# EAGLE design Placa (EAGLE 8.3.1)
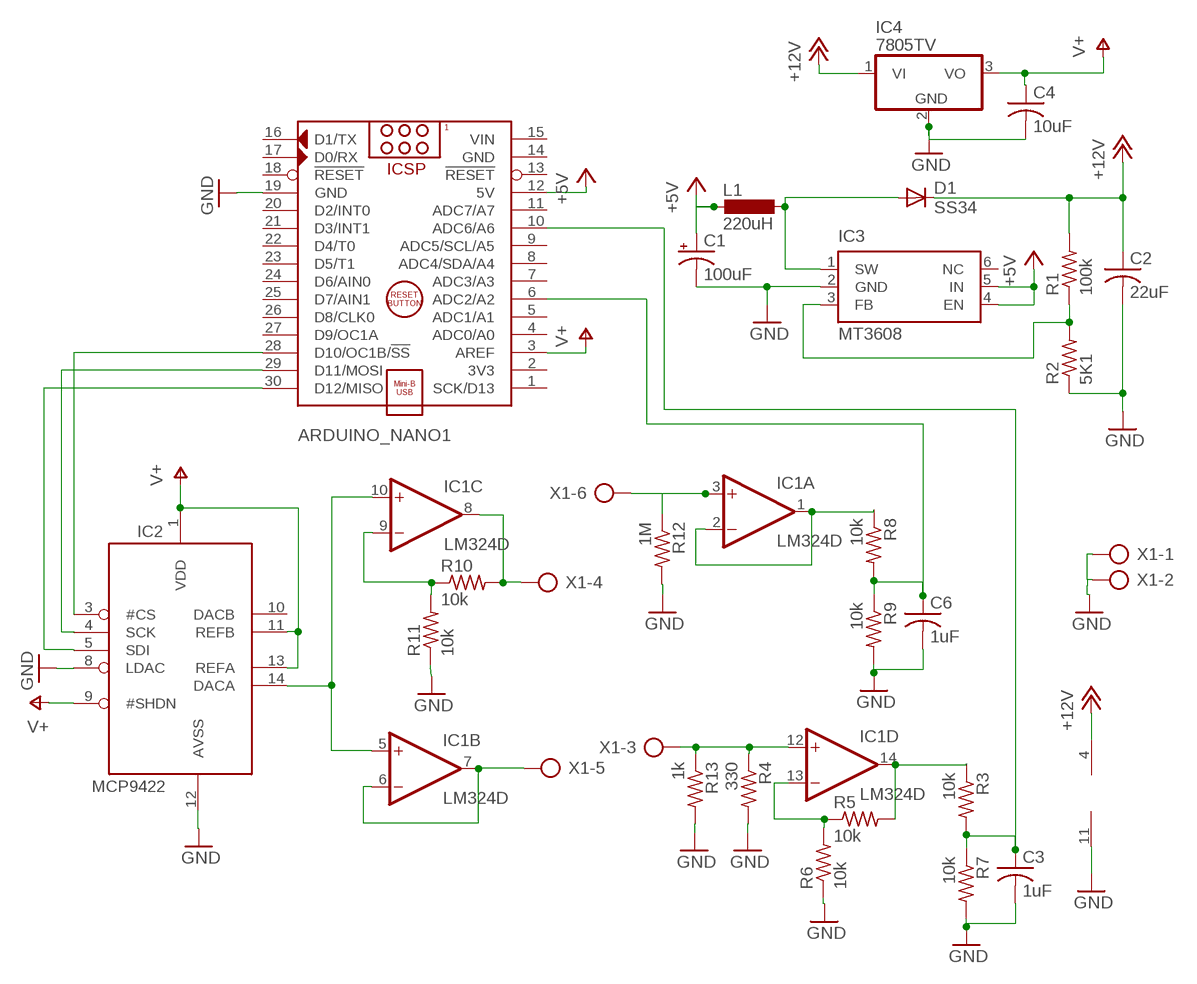
[diagram p0: schematic, sheet 1]

## Parts
ARDUINO_NANO1  ARDUINO_NANO  [ARDUINO_NANO]
C1  100uF  CPOL-USE2.5-6  [E2,5-6]
C2  22uF  C-USC1206  [C1206]
C3  1uF  C-USC0805  [C0805]
C4  10uF  C-USC0805  [C0805]
C6  1uF  C-USC0805  [C0805]
D1  SS34  DIODE-DO-214AC  [DO-214AC]
IC1  LM324D  [SO14]
IC2  MCP4922  MCP4922MCP4922-SO14  [SO14]
IC3  MT3608  STF202-22T1G  [SOT23-6]
IC4  7805TV  [TO220V]
L1  220uH  DO3316P  [DO3316P]
R1  100k  R-US_R0805  [R0805]
R2  5K1  R-US_R0805  [R0805]
R3  10k  R-US_R0805  [R0805]
R4  330  R-US_R0805  [R0805]
R5  10k  R-US_R0805  [R0805]
R6  10k  R-US_R0805  [R0805]
R7  10k  R-US_R0805  [R0805]
R8  10k  R-US_R0805  [R0805]
R9  10k  R-US_R0805  [R0805]
R10  10k  R-US_R0805  [R0805]
R11  10k  R-US_R0805  [R0805]
R12  1M  R-US_R0805  [R0805]
R13  1k  R-US_R0805  [R0805]
X1  AK500/6  [AK500/6]

## Nets
+5V: ARDUINO_NANO1.12(5V) C1.+ IC3.4(EN) IC3.5(IN) L1.1
+12V: C2.1 D1.C IC1.4(P:V+) IC4.1(VI) R1.2
GND: ARDUINO_NANO1.19(GND) C1.- C2.2 C3.2 C4.2 C6.2 IC1.11(P:V-) IC2.8(LDAC) IC2.12(AVSS) IC3.2(GND) IC4.2(GND) R2.1 R4.2 R6.1 R7.2 R9.2 R11.1 R12.2 R13.2 X1.1 X1.2
N$1: D1.A IC3.1(SW) L1.2
N$2: ARDUINO_NANO1.28(D10/OC1B/!SS) IC2.3(#CS)
N$3: ARDUINO_NANO1.29(D11/MOSI) IC2.4(SCK)
N$4: ARDUINO_NANO1.30(D12/MISO) IC2.5(SDI)
N$5: IC3.3(FB) R1.1 R2.2
N$6: IC1.14(D:OUT) R3.1 R5.2
N$7: IC1.9(C:-IN) R10.1 R11.2
N$8: IC1.12(D:+IN) R4.1 R13.1 X1.3
N$9: IC1.13(D:-IN) R5.1 R6.2
N$10: ARDUINO_NANO1.6(ADC2/A2) C6.1 R8.2 R9.1
N$11: IC1.3(A:+IN) R12.1 X1.6
N$12: IC1.1(A:OUT) IC1.2(A:-IN) R8.1
N$14: IC1.6(B:-IN) IC1.7(B:OUT) X1.5
N$16: IC1.8(C:OUT) R10.2 X1.4
N$17: IC1.5(B:+IN) IC1.10(C:+IN) IC2.14(DACA)
N$18: ARDUINO_NANO1.10(ADC6/A6) C3.1 R3.2 R7.1
V+: ARDUINO_NANO1.3(AREF) C4.1 IC2.1(VDD) IC2.9(#SHDN) IC2.11(REFB) IC2.13(REFA) IC4.3(VO)
Unconnected: ARDUINO_NANO1.1(SCK/D13) ARDUINO_NANO1.2(3V3) ARDUINO_NANO1.4(ADC0/A0) ARDUINO_NANO1.5(ADC1/A1) ARDUINO_NANO1.7(ADC3/A3) ARDUINO_NANO1.8(ADC4/SDA/A4) ARDUINO_NANO1.9(ADC5/SCL/A5) ARDUINO_NANO1.11(ADC7/A7) ARDUINO_NANO1.13(!RESET) ARDUINO_NANO1.16(D1/TX) ARDUINO_NANO1.17(D0/RX) ARDUINO_NANO1.18(!RESET) ARDUINO_NANO1.20(D2/INT0) ARDUINO_NANO1.21(D3/INT1) ARDUINO_NANO1.22(D4/T0) ARDUINO_NANO1.23(D5/T1) ARDUINO_NANO1.24(D6/AIN0) ARDUINO_NANO1.25(D7/AIN1) ARDUINO_NANO1.26(D8/CLK0) ARDUINO_NANO1.27(D9/OC1A) IC2.10(DACB) IC3.6(NC)

## Power pins joined to a net without a drawn wire
GND: ARDUINO_NANO1.14(GND)
VIN: ARDUINO_NANO1.15(VIN)

## Library data of the parts
ARDUINO_NANO1 = ArduinoNanoV30:ARDUINO_NANO: Arduino Nano V3.0 Module Overview: The Arduino Nano is a small, complete, and breadboard-friendly board based on the ATmega328 (Arduino Nano 3.x) or ATmega168 (Arduino Nano 2.x). It has more or less the same functionality of the Arduino Duemilanove, but in a different package. It lacks only a DC power jack, and works with a Mini-B USB cable instead of a standard one. The Nano was designed and is being produced by Gravitech <http://www.gravitech.us/arna30wiatp.html>. General specifications: Item Value Microcontroller Atmel ATmega168 or ATmega328 Operating Voltage (logic level) 5 V Input Voltage (recommended) 7-12 V Input Voltage (limits) 6-20 V Digital I/O Pins 14 (of which 6 provide PWM output) Analog Input Pins 8 DC Current per I/O Pin 40 mA Flash Memory 16 KB (ATmega168) or 32 KB (ATmega328) of which 2 KB used by bootloader SRAM 1 KB (ATmega168) or 2 KB (ATmega328) EEPROM 512 bytes (ATmega168) or 1 KB (ATmega328) Clock Speed 16 MHz Dimensions (Inches) 0.73" x 1.70" Dimensions (mm) 18mm x 45mm Overall height About 9 mm (not including pins) Weigth 5 g Power: The Arduino Nano can be powered via the Mini-B USB connection, 6-20V unregulated external power supply (pin 30), or 5V regulated external power supply (pin 27). The power source is automatically selected to the highest voltage source. Memory: The ATmega168 has 16 KB of flash memory for storing code (of which 2 KB is used for the bootloader); the ATmega328 has 32 KB, (also with 2 KB used for the bootloader). The ATmega168 has 1 KB of SRAM and 512 bytes of EEPROM (which can be read and written with the EEPROM library); the ATmega328 has 2 KB of SRAM and 1 KB of EEPROM. Input and Output: Each of the 14 digital pins on the Nano can be used as an input or output, using pinMode(), digitalWrite(), and digitalRead() functions. They operate at 5 volts. Each pin can provide or receive a maximum of 40 mA and has an internal pull-up resistor (disconnected by default) of 20-50 kOhms. In addition, some pins have specialized functions. Visit Arduino - ArduinoBoardNano <https://www.arduino.cc/en/Main/ArduinoBoardNano>
C1 = rcl:CPOL-US: POLARIZED CAPACITOR, American symbol
C2-C4 C6 = rcl:C-US: CAPACITOR, American symbol
D1 = diode:DIODE-: DIODE
IC1 = linear:LM324: OP AMP
IC2 = adafruit2:MCP4922
IC3 = MT3608:STF202-22T1G: USB Filter with ESD Protection Source: http://www.onsemi.com/pub_link/Collateral/STF202-22T1-D.PDF; MF: ON Semiconductor; MPN: STF202-22T1G; OC_FARNELL: 1651958; OC_NEWARK: 45J2271
IC4 = linear:78*: Positive VOLTAGE REGULATOR Source: http://cache.national.com/ds/LM/LM78L05.pdf http://www.fairchildsemi.com/ds/LM/LM7805.pdf
L1 = inductor-coilcraft:DO3316P: COILCRAFT; OC_FARNELL: unknown; OC_NEWARK: unknown
R1-R13 = resistor:R-US_: RESISTOR, American symbol
X1 = con-ptr500:AK500/6: CONNECTOR; OC_FARNELL: unknown; OC_NEWARK: unknown

## Net classes
0 default: width 0.381 mm, clearance 0.102 mm

## Board
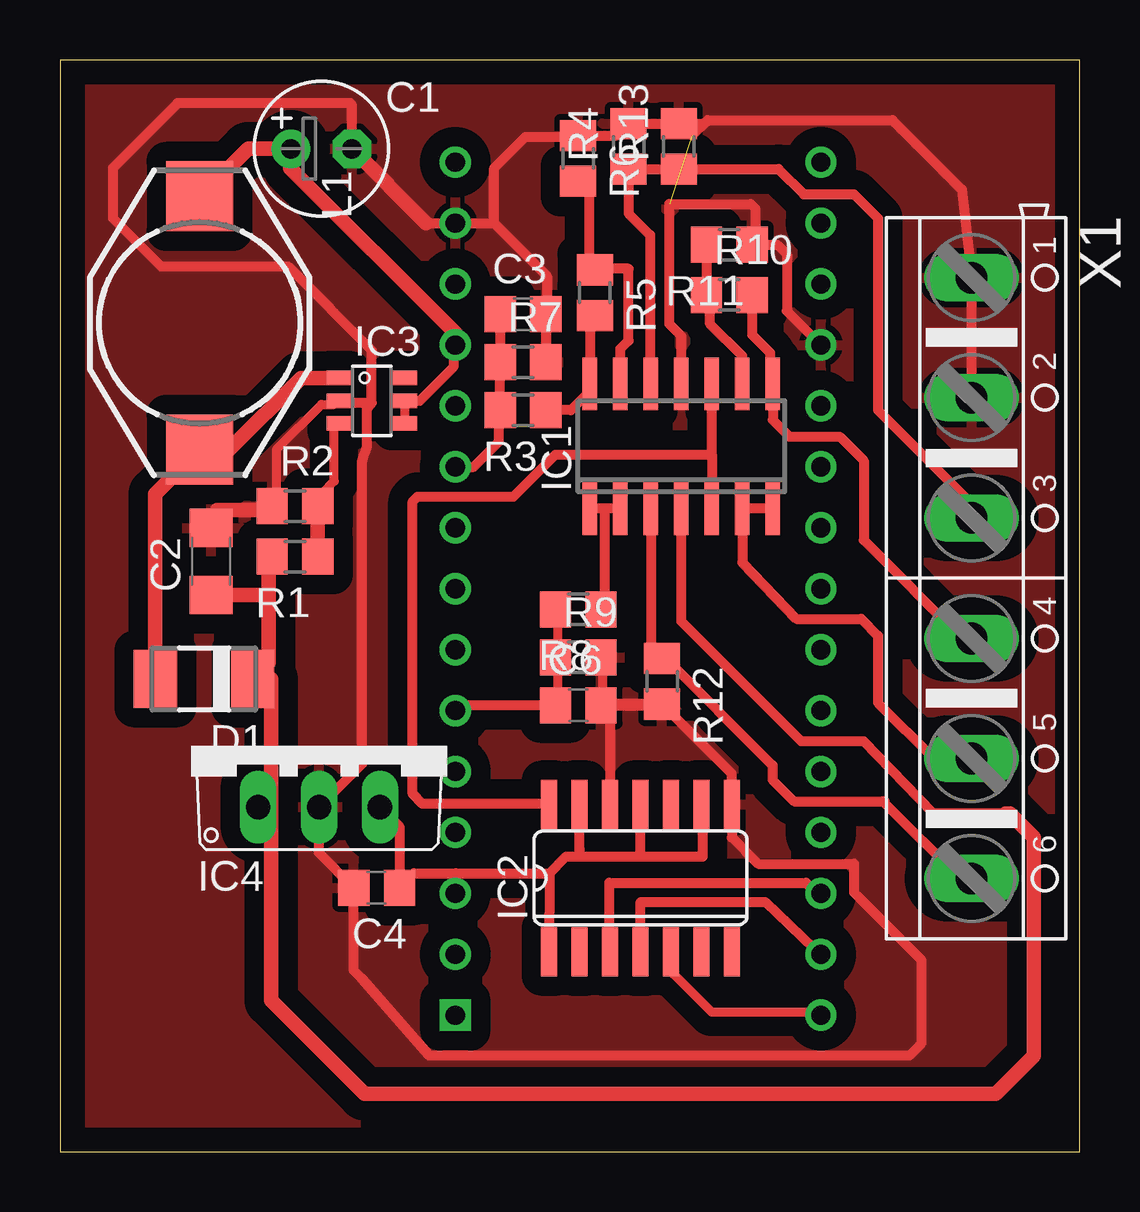
[diagram p1: board, top side]
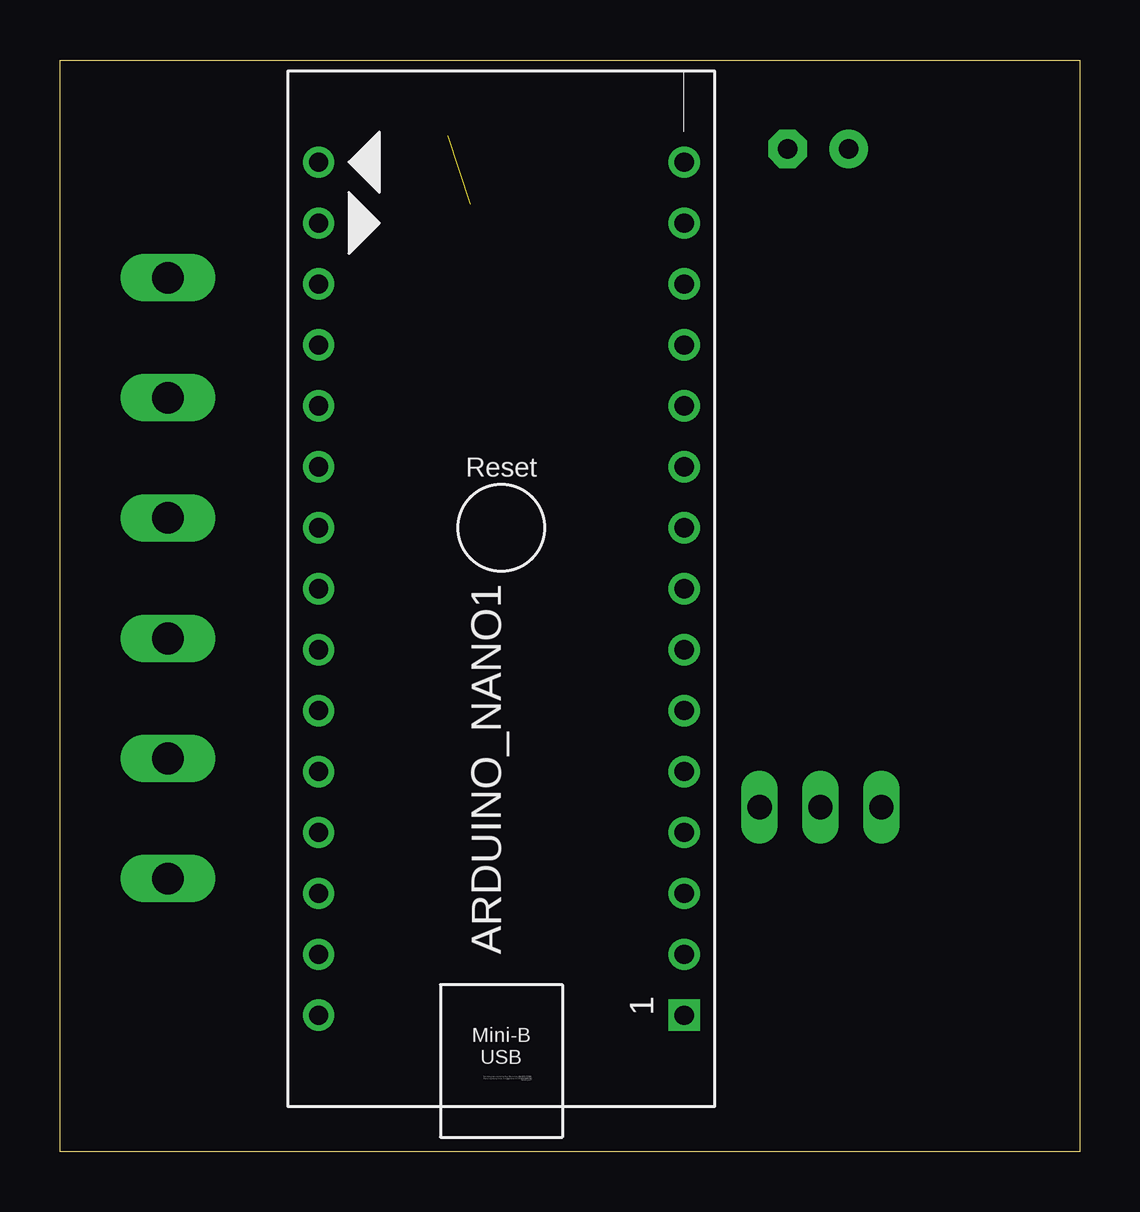
[diagram p2: board, bottom side, seen from below]

Size 42.5 x 45.5 mm. Coordinates in mm from the lower left corner, seen from the top.
Outline: 0,0 42.5,0 42.5,45.5 0,45.5 0,0
Copper layers (1*16): Top 0.035mm / dielectric 1.5mm / Bottom 0.035mm
Design rules "default": minimum track width 6mil, minimum drill 0.35mm, track to track 6mil, track to pad 6mil, pad to pad 6mil, via to via 6mil, smd to smd 6mil, copper to edge 40mil, drill to drill 6mil, minimum pad ring 10mil, minimum via ring 8mil, stop-mask expansion 4mil, vias tented up to drill 0mil, thermal gap 10mil

### Footprints (pad centres in the part's own frame; a part is rotated, then mirrored left to right if it is on the bottom)
ARDUINO_NANO = drill 0.8 square: 1 -20.32,-7.62 | drill 0.8: 2 -17.78,-7.62; 3 -15.24,-7.62; 4 -12.7,-7.62; 5 -10.16,-7.62; 6 -7.62,-7.62; 7 -5.08,-7.62; 8 -2.54,-7.62; 9 0,-7.62; 10 2.54,-7.62; 11 5.08,-7.62; 12 7.62,-7.62; 13 10.16,-7.62; 14 12.7,-7.62; 15 15.24,-7.62; 16 15.24,7.62; 17 12.7,7.62; 18 10.16,7.62; 19 7.62,7.62; 20 5.08,7.62; 21 2.54,7.62; 22 0,7.62; 23 -2.54,7.62; 24 -5.08,7.62; 25 -7.62,7.62; 26 -10.16,7.62; 27 -12.7,7.62; 28 -15.24,7.62; 29 -17.78,7.62; 30 -20.32,7.62
E2,5-6 = drill 0.813 pad 1.6: + -1.27,0 | drill 0.813 pad 1.6 octagon: - 1.27,0
C1206 = smd 1.6 x 1.8: 1 -1.4,0; 2 1.4,0
C0805 = smd 1.3 x 1.5: 1 -0.95,0; 2 0.95,0
DO-214AC = smd 1.8 x 2.4: A 2.025,0; C -2.025,0
SO14 = smd 0.6 x 2.2: 1 -3.81,-2.6; 2 -2.54,-2.6; 3 -1.27,-2.6; 4 0,-2.6; 5 1.27,-2.6; 6 2.54,-2.6; 7 3.81,-2.6; 8 3.81,2.6; 9 2.54,2.6; 10 1.27,2.6; 11 0,2.6; 12 -1.27,2.6; 13 -2.54,2.6; 14 -3.81,2.6
SO14' = smd 0.66 x 2.032: 1 -3.81,-3.073; 2 -2.54,-3.073; 3 -1.27,-3.073; 4 0,-3.073; 5 1.27,-3.073; 6 2.54,-3.073; 7 3.81,-3.073; 8 3.81,3.073; 9 2.54,3.073; 10 1.27,3.073; 11 0,3.073; 12 -1.27,3.073; 13 -2.54,3.073; 14 -3.81,3.073
SOT23-6 = smd 0.6 x 1.05: 1 -0.95,-1.35; 2 0,-1.35; 3 0.95,-1.35; 4 0.95,1.35; 5 0,1.35; 6 -0.95,1.35
TO220V = drill 1.016 long: 1 -2.54,-2.54; 2 0,-2.54; 3 2.54,-2.54
DO3316P = smd 2.92 x 2.79: 1 -5.28,0; 2 5.28,0
R0805 = smd 1.3 x 1.5: 1 -0.95,0; 2 0.95,0
AK500/6 = drill 1.321 long: 1 -12.522,0; 2 -7.518,0; 3 -2.515,0; 4 2.515,0; 5 7.518,0; 6 12.522,0

### Placement (x,y rotation side)
ARDUINO_NANO1  24.1,26 90 bottom
C1  10.9,41.8 0 top
C2  6.3,24.6 90 top
C3  19.3,34.9 0 top
C4  13.2,11 180 top
C6  21.6,18.6 0 top
D1  6,19.7 180 top
IC1  25.9,29.4 0 top
IC2  MCP4922  [SO14']  24.2,11.4 0 top
IC3  13,31.3 270 top
IC4  10.8,16.9 0 top
L1  5.82,34.54 270 top
R1  9.8,24.8 180 top
R2  9.8,26.9 0 top
R3  19.3,30.9 180 top
R4  23.7,41.9 90 top
R5  22.3,35.8 270 top
R6  21.6,41.4 270 top
R7  19.3,32.9 0 top
R8  21.6,22.6 180 top
R9  21.6,20.6 0 top
R10  27.9,35.7 0 top
R11  27.9,37.8 180 top
R12  25.1,19.6 270 top
R13  25.8,41.9 90 top
X1  38,23.9 270 top

### Tracks (layer width: path | path; a pad name or v marks a point on that pad's centre or on a via)
+5V
  Top 0.381: IC3.4 14.37,30.61 14.37,31.14 IC3.5
  Top 0.406: IC3.5 15,31.3 16.4,32.7 16.4,33.54 ARDUINO_NANO1.12 16.48,34.12 | 5.84,39.8 L1.1
  Top 0.61: 5.84,39.8 7.84,41.8 C1.+ 9.6,41.77 9.6,41 16.48,34.12
+12V
  Top 0.406: 39.42,14.1 36.4,14.1 33.5,17.1 30.9,17.1 25.9,22.1 IC1.4 | IC4.1 8.35,14.27 8.8,14.27
  Top 0.61: R1.2 8.7,24.65 8.7,23.1 | 8.7,23.1 8.6,23.2 C2.1 | 8.7,23.1 8.7,20.38 D1.C 8.8,19.7 8.8,14.27 8.8,6.3 12.7,2.4 39,2.4 40.6,4 40.6,13.1 39.6,14.1 39.42,14.1
GND  (1 unrouted)
  Top 0.381: IC3.2 11.44,31.14 10.9,31.14 9.04,29.27 9.04,27.41 R2.1 8.77,27.14 | C6.2 22.64,18.6 22.64,20.47 R9.2 | 27.97,15.14 27.97,14.6 IC2.8
  Top 0.406: X1.2 X1.1 37.6,40.1 34.7,43 27,43 | 28.99,37.8 R11.1 | 28.99,37.8 29.9,37.8 30.3,37.4 30.3,35.04 ARDUINO_NANO1.19 | R7.2 C3.2 20.3,34.95 20.3,36.5 18.1,38.7 | IC1.11 25.9,34 25.4,34.5 25.4,39.5 28.8,39.5 28.99,39.31 28.99,37.8 | 6.55,26.75 C2.2 | C1.- 12.17,43.63 12.1,43.7 4.9,43.7 2.2,41 2.2,38.9 4.2,36.9 9.5,36.9 13,33.4 13,31.2 | 13,31.2 11.75,31.2 IC3.2 | 27,43 26.35,42.35 | 13,31.2 12.8,31 12.8,29.4 12.6,28.8 12.6,16.16 IC4.2 10.8,12.45 C4.2 12.25,7.55 12.6,7.2 15.4,4 35.4,4 35.9,4.5 35.9,8 33.1,10.8 33.1,12 29.1,12 28.01,13.09 IC2.8 28.01,15.74 R12.2 | R12.2 25.05,18.6 C6.2 22.93,18.22 IC2.12 | R12.2 22.68,18.65 22.64,18.6 | 15.27,38.7 ARDUINO_NANO1.14 18.1,38.7 | 18.1,38.7 18.1,41 19.4,42.3 21.55,42.3 R6.1 23.2,42.35 R4.2 R13.2 26.85,42.85 27,43
  Top 0.61: R2.1 8.7,26.75 6.55,26.75 | C1.- 15.27,38.7
  pour Top (isolate 0.813): 0.3,45.3 0.3,0.3 1.4,0.3 42.3,0.3 42.3,45.3
N$1
  Top 0.381: IC3.1 11.44,32.21 | 5.83,29.27 L1.2
  Top 0.61: D1.A 3.97,27.41 L1.2 7.06,29.26 10.05,32.25 IC3.1
N$2
  Top 0.406: IC2.3 22.9,8.36 22.9,11.2 31.1,11.2 31.64,10.76 ARDUINO_NANO1.28
N$3
  Top 0.381: 24.24,9 24.24,8.47 IC2.4 | 31.7,8.47 ARDUINO_NANO1.29
  Top 0.406: IC2.4 24.2,10.4 29.4,10.4 31.43,8.47 31.7,8.47
N$4
  Top 0.381: IC2.5 25.57,8.2 25.57,7.4 27.17,5.8 31.7,5.8 ARDUINO_NANO1.30
N$5
  Top 0.381: IC3.3 11.44,30.34 11.44,27.94 10.9,27.41 R2.2
  Top 0.61: R1.1 R2.2
N$6
  Top 0.406: 20.47,30.9 20.7,30.9 | 20.47,30.9 R3.1 | R5.2 22.09,34.64 IC1.14 22.09,31.69 21.3,30.9 20.47,30.9
N$7
  Top 0.406: IC1.9 28.44,33.16 27.1,34.5 27.1,35.55 R10.1 R11.2
N$8
  Top 0.406: IC1.12 24.6,32.03 24.6,38.2 23.7,39.1 R4.1 R13.1 29.95,40.95 31,39.9 33.1,39.9 34.1,38.9 34.1,30.9 37.9,27.1 37.9,26.52 X1.3
N$9
  Top 0.406: 22.05,36.75 21.8,37 | 22.05,36.75 R5.1 | IC1.13 23.36,33.46 23.7,33.8 23.7,36.8 22.1,36.8 22.05,36.75 | R6.2 22.05,40 22.05,36.75
N$10
  Top 0.381: C6.1 20.77,18.6 20.77,20.47 R9.1 20.77,20.74 20.77,22.61 R8.2
  Top 0.406: ARDUINO_NANO1.6 16.7,18.6 20.77,18.6
N$11
  Top 0.406: 24.63,26.07 IC1.3 24.63,21.17 25.09,20.71 | 25.09,20.71 29.7,16.1 29.7,15.5 30.6,14.6 34.3,14.6 | 34.3,14.6 34.38,14.6 | 34.3,14.6 37.52,11.38 X1.6 | R12.1 25.1,20.71 25.09,20.71
N$12
  Top 0.406: IC1.2 22.7,26.8 | 22.7,26.8 IC1.1 | 22.7,26.8 22.7,22.75 R8.1
N$14
  Top 0.406: IC1.7 IC1.6 28.44,24.56 30.7,22.2 33.4,22.2 34.1,21.5 34.1,18.7 36.42,16.38 X1.5
N$16
  Top 0.406: R10.2 28.85,34.05 29.6,33.3 29.6,32.11 IC1.8 29.71,30.49 30.4,29.8 32.5,29.8 33.5,28.8 33.5,25.48 37.6,21.38 X1.4
N$17
  Top 0.406: 27.17,29.05 IC1.10 | 27.17,29.05 IC1.5 | IC2.14 20.36,14.5 15.1,14.5 14.7,14.9 14.7,27.1 14.9,27.3 18.9,27.3 20.65,29.05 27.17,29.05
N$18
  Top 0.406: C3.1 R7.1 18.35,31.03 | 18.35,31.03 R3.2 18.3,30.85 18.3,29.6 17.24,28.54 ARDUINO_NANO1.10 | 18.34,31.04 arc-90 18.35,31.03
V+
  Top 0.406: IC4.3 14.15,13.55 C4.1 14.75,11.6 16.5,11.6 | 16.5,11.6 16.48,11.58 ARDUINO_NANO1.3 | 16.5,11.6 20.4,11.6 | 20.4,11.6 IC2.1 | 20.4,11.6 21.1,12.3 21.6,12.3 21.66,12.36 21.66,12.6 | 21.66,12.6 IC2.13 | 21.66,12.6 21.66,12.3 24.2,12.3 | 24.2,12.3 IC2.11 | 24.2,12.3 26.8,12.3 26.8,14.47 IC2.9